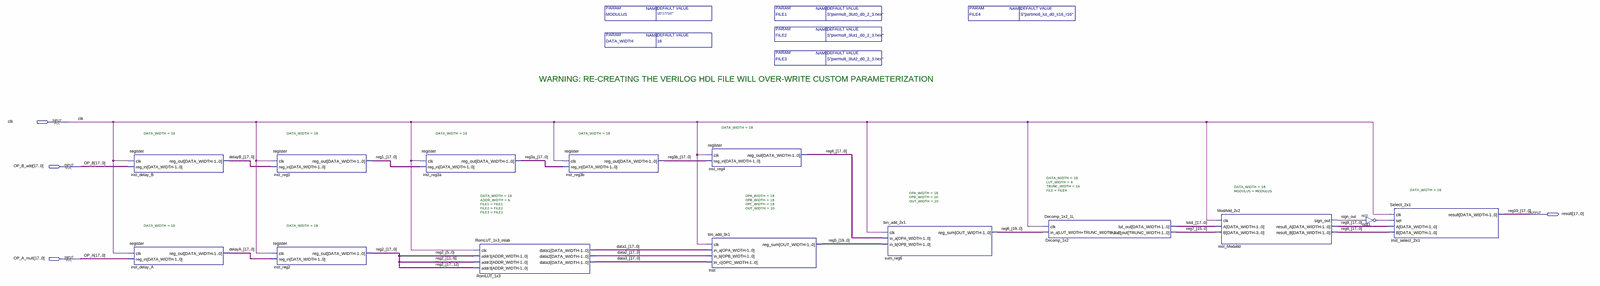
[diagram p0: schematic sheet, whole]
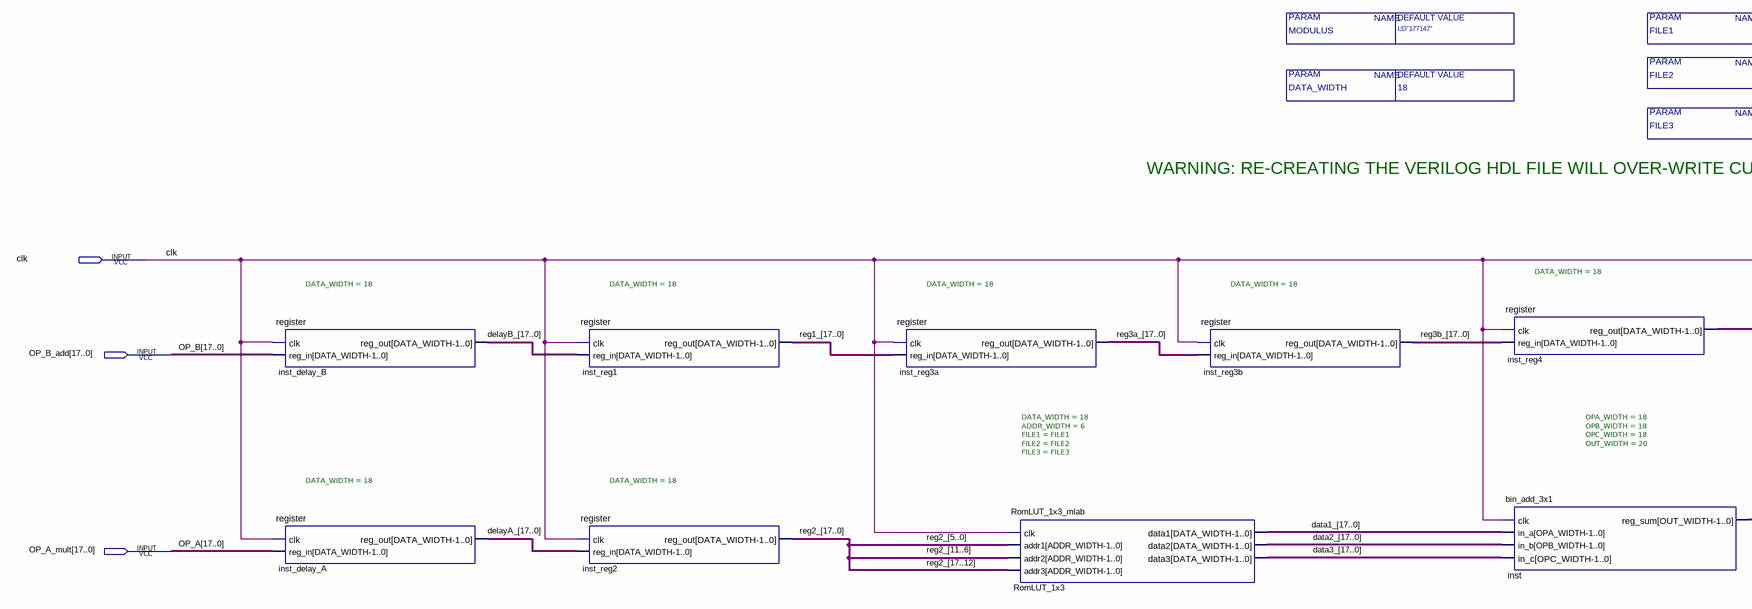
[diagram p1: schematic sheet, left part]
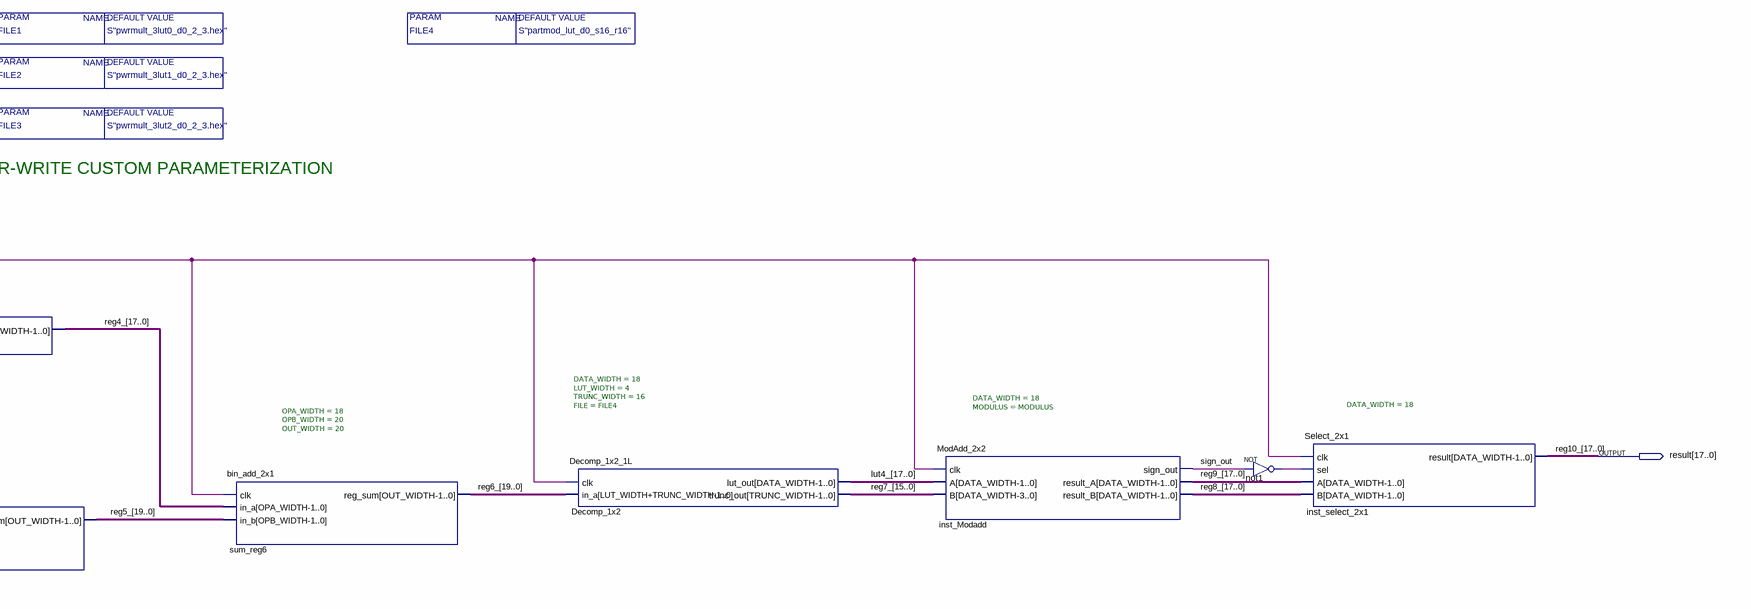
[diagram p2: schematic sheet, right part]
// Quartus schematic ModMultAdd_8L_v2.bdf as structural Verilog: 14 symbols, 4 pins
module ModMultAdd_8L_v2 #(parameter MODULUS = "UD\"177147\"", parameter DATA_WIDTH = 18, parameter FILE1 = "S\"pwrmult_3lut0_d0_2_3.hex\"", parameter FILE2 = "S\"pwrmult_3lut1_d0_2_3.hex\"", parameter FILE3 = "S\"pwrmult_3lut2_d0_2_3.hex\"", parameter FILE4 = "S\"partmod_lut_d0_s16_r16\"") (
  input  clk,
  input  [17:0] OP_B_add,
  input  [17:0] OP_A_mult,
  output [17:0] result
);

  wire not1_out, sign_out;
  wire [15:0] reg7_;
  wire [17:0] data1_, data2_, data3_, delayA_, delayB_, lut4_, reg1_, reg2_, reg3a_, reg3b_, reg4_, reg8_,
       reg9_;
  wire [19:0] reg5_, reg6_;

  register #(.DATA_WIDTH(18)) inst_delay_B (.clk(clk), .reg_in(OP_B_add), .reg_out(delayB_));
  register #(.DATA_WIDTH(18)) inst_delay_A (.clk(clk), .reg_in(OP_A_mult), .reg_out(delayA_));
  register #(.DATA_WIDTH(18)) inst_reg1 (.clk(clk), .reg_in(delayB_), .reg_out(reg1_));
  register #(.DATA_WIDTH(18)) inst_reg2 (.clk(clk), .reg_in(delayA_), .reg_out(reg2_));
  register #(.DATA_WIDTH(18)) inst_reg3a (.clk(clk), .reg_in(reg1_), .reg_out(reg3a_));
  RomLUT_1x3_mlab #(.DATA_WIDTH(18), .ADDR_WIDTH(6), .FILE1(FILE1), .FILE2(FILE2), .FILE3(FILE3)) RomLUT_1x3 (
    .clk(clk), .addr1(reg2_[5:0]), .addr2(reg2_[11:6]), .addr3(reg2_[17:12]), .data1(data1_), .data2(data2_),
    .data3(data3_));
  register #(.DATA_WIDTH(18)) inst_reg3b (.clk(clk), .reg_in(reg3a_), .reg_out(reg3b_));
  register #(.DATA_WIDTH(18)) inst_reg4 (.clk(clk), .reg_in(reg3b_), .reg_out(reg4_));
  bin_add_3x1 #(.OPA_WIDTH(18), .OPB_WIDTH(18), .OPC_WIDTH(18), .OUT_WIDTH(20)) inst (
    .clk(clk), .in_a(data1_), .in_b(data2_), .in_c(data3_), .reg_sum(reg5_));
  bin_add_2x1 #(.OPA_WIDTH(18), .OPB_WIDTH(20), .OUT_WIDTH(20)) sum_reg6 (
    .clk(clk), .in_a(reg4_), .in_b(reg5_), .reg_sum(reg6_));
  Decomp_1x2_1L #(.DATA_WIDTH(18), .LUT_WIDTH(4), .TRUNC_WIDTH(16), .FILE(FILE4)) Decomp_1x2 (
    .clk(clk), .in_a(reg6_), .lut_out(lut4_), .trunc_out(reg7_));
  ModAdd_2x2 #(.DATA_WIDTH(18), .MODULUS(MODULUS)) inst_Modadd (
    .clk(clk), .A(lut4_), .B(reg7_), .sign_out(sign_out), .result_A(reg9_), .result_B(reg8_));
  not not1 (not1_out, sign_out);
  Select_2x1 #(.DATA_WIDTH(18)) inst_select_2x1 (.clk(clk), .sel(not1_out), .A(reg9_), .B(reg8_), .result(result));

  // Other names for the same wires on the sheet: OP_A[17:0] = OP_A_mult; OP_B[17:0] = OP_B_add; reg10_[17:0] = result

  // Notes on the sheet:
  //   WARNING: RE-CREATING THE VERILOG HDL FILE WILL OVER-WRITE CUSTOM PARAMETERIZATION
endmodule
